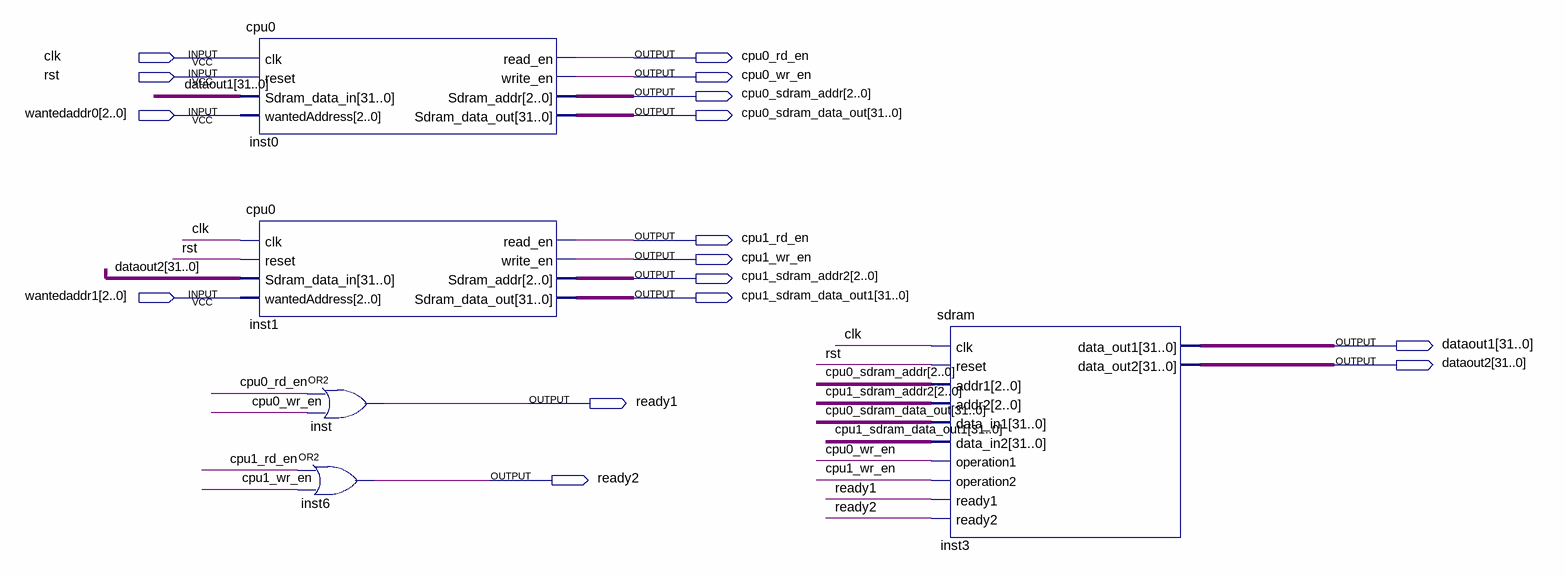
[diagram p0: schematic sheet]
// Quartus schematic TransactionsBetweenCPU.bdf as structural Verilog: 5 symbols, 16 pins
module TransactionsBetweenCPU (
  input  clk,
  input  rst,
  input  [2:0] wantedaddr0,
  input  [2:0] wantedaddr1,
  output cpu0_rd_en,
  output cpu0_wr_en,
  output [2:0] cpu0_sdram_addr,
  output [31:0] cpu0_sdram_data_out,
  output cpu1_rd_en,
  output cpu1_wr_en,
  output [2:0] cpu1_sdram_addr2,
  output [31:0] cpu1_sdram_data_out1,
  output [31:0] dataout1,
  output [31:0] dataout2,
  output ready1,
  output ready2
);

  cpu0 inst0 (
    .clk(clk), .reset(rst), .Sdram_data_in(dataout1), .wantedAddress(wantedaddr0), .read_en(cpu0_rd_en),
    .write_en(cpu0_wr_en), .Sdram_addr(cpu0_sdram_addr), .Sdram_data_out(cpu0_sdram_data_out));
  cpu0 inst1 (
    .clk(clk), .reset(rst), .Sdram_data_in(dataout2), .wantedAddress(wantedaddr1), .read_en(cpu1_rd_en),
    .write_en(cpu1_wr_en), .Sdram_addr(cpu1_sdram_addr2), .Sdram_data_out(cpu1_sdram_data_out1));
  or inst (ready1, cpu0_rd_en, cpu0_wr_en);
  or inst6 (ready2, cpu1_rd_en, cpu1_wr_en);
  sdram inst3 (
    .clk(clk), .reset(rst), .addr1(cpu0_sdram_addr), .addr2(cpu1_sdram_addr2),
    .data_in1(cpu0_sdram_data_out), .data_in2(cpu1_sdram_data_out1), .operation1(cpu0_wr_en),
    .operation2(cpu1_wr_en), .ready1(ready1), .ready2(ready2), .data_out1(dataout1), .data_out2(dataout2));
endmodule
